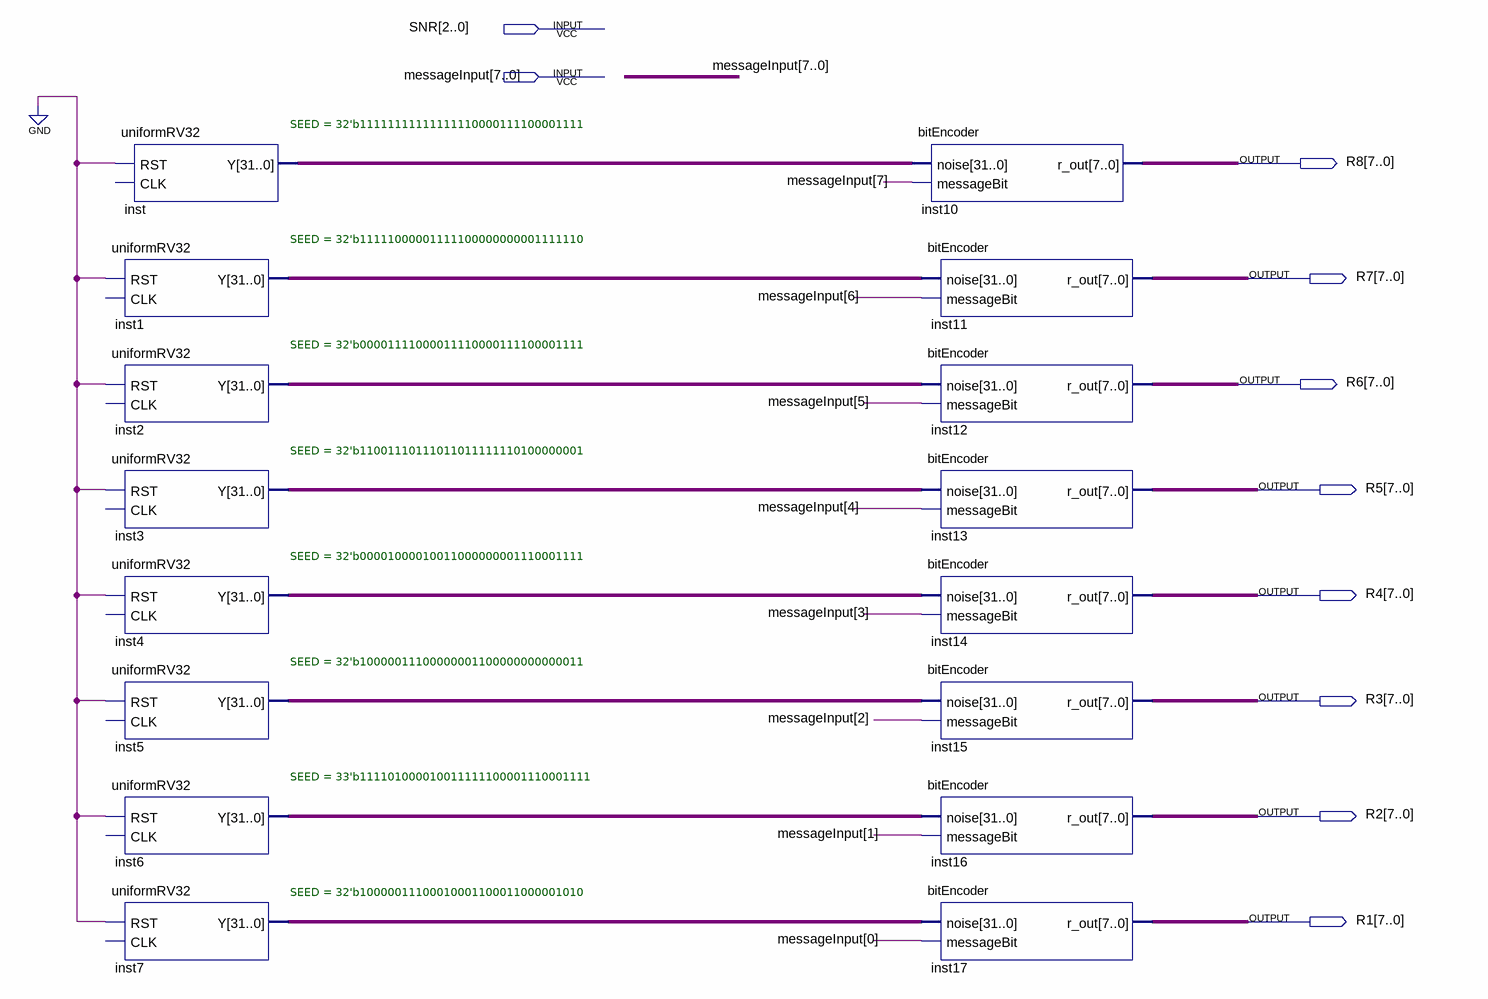
[diagram p0: schematic sheet]
// Quartus schematic PreTrellisNosieGen.bdf as structural Verilog: 16 symbols, 10 pins
module PreTrellisNosieGen (
  input  [2:0] SNR,
  input  [7:0] messageInput,
  output [7:0] R8,
  output [7:0] R7,
  output [7:0] R6,
  output [7:0] R5,
  output [7:0] R4,
  output [7:0] R3,
  output [7:0] R2,
  output [7:0] R1
);

  wire [31:0] inst1_y, inst2_y, inst3_y, inst4_y, inst5_y, inst6_y, inst7_y, inst_y;

  uniformRV32 #(.SEED(32'b11111111111111110000111100001111)) inst (.RST(1'b0), .Y(inst_y));  // open: CLK
  uniformRV32 #(.SEED(32'b11111000001111100000000001111110)) inst1 (.RST(1'b0), .Y(inst1_y));  // open: CLK
  uniformRV32 #(.SEED(32'b00001111000011110000111100001111)) inst2 (.RST(1'b0), .Y(inst2_y));  // open: CLK
  uniformRV32 #(.SEED(32'b11001110111011011111110100000001)) inst3 (.RST(1'b0), .Y(inst3_y));  // open: CLK
  uniformRV32 #(.SEED(32'b00001000010011000000001110001111)) inst4 (.RST(1'b0), .Y(inst4_y));  // open: CLK
  uniformRV32 #(.SEED(32'b10000011100000001100000000000011)) inst5 (.RST(1'b0), .Y(inst5_y));  // open: CLK
  uniformRV32 #(.SEED(33'b111101000010011111100001110001111)) inst6 (.RST(1'b0), .Y(inst6_y));  // open: CLK
  uniformRV32 #(.SEED(32'b10000011100010001100011000001010)) inst7 (.RST(1'b0), .Y(inst7_y));  // open: CLK
  bitEncoder inst10 (.noise(inst_y), .messageBit(messageInput[7]), .r_out(R8));
  bitEncoder inst11 (.noise(inst1_y), .messageBit(messageInput[6]), .r_out(R7));
  bitEncoder inst12 (.noise(inst2_y), .messageBit(messageInput[5]), .r_out(R6));
  bitEncoder inst13 (.noise(inst3_y), .messageBit(messageInput[4]), .r_out(R5));
  bitEncoder inst14 (.noise(inst4_y), .messageBit(messageInput[3]), .r_out(R4));
  bitEncoder inst15 (.noise(inst5_y), .messageBit(messageInput[2]), .r_out(R3));
  bitEncoder inst16 (.noise(inst6_y), .messageBit(messageInput[1]), .r_out(R2));
  bitEncoder inst17 (.noise(inst7_y), .messageBit(messageInput[0]), .r_out(R1));
endmodule
